// Quartus schematic pll.bdf as structural Verilog: 2 symbols, 3 pins
module pll (
  input  pin_name1,
  output pin_name3,
  output pin_name2
);

  altpll0 inst1 (.inclk0(pin_name1), .c0(pin_name3), .c1(pin_name2));
  altpll0 inst ();  // open: inclk0, c0, c1
endmodule
